# Altium schematic sheet Top.SchDoc
size A4; SheetNumber: 1; SheetTotal: 5
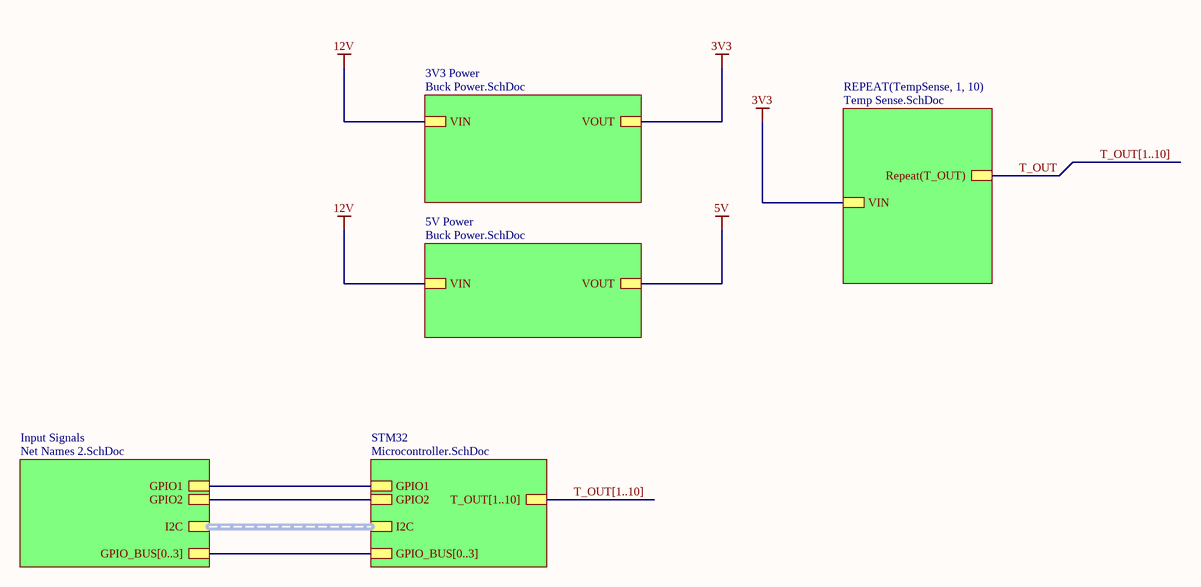
[diagram p0: Top.SchDoc]

## Sub-sheets
3V3 Power = Buck Power.SchDoc: VIN, VOUT
5V Power = Buck Power.SchDoc: VIN, VOUT
Input Signals = Net Names 2.SchDoc: GPIO1, GPIO2, I2C (harness I2C), GPIO_BUS[0..3]
REPEAT(TempSense, 1, 10) = Temp Sense.SchDoc: VIN, Repeat(T_OUT)
STM32 = Microcontroller.SchDoc: GPIO1, GPIO2, I2C (harness I2C), GPIO_BUS[0..3], T_OUT[1..10]

## Nets
3V3: sheet 3V3 Power/VOUT, sheet REPEAT(TempSense, 1, 10)/VIN
5V: sheet 5V Power/VOUT
12V: sheet 3V3 Power/VIN, sheet 5V Power/VIN
T_OUT: sheet REPEAT(TempSense, 1, 10)/Repeat(T_OUT)
(unnamed): sheet Input Signals/GPIO1, sheet STM32/GPIO1
(unnamed): sheet Input Signals/GPIO2, sheet STM32/GPIO2

## Buses and harness runs
bus sheet Input Signals/GPIO_BUS[0..3] = sheet STM32/GPIO_BUS[0..3]
bus T_OUT[1..10]
bus T_OUT[1..10] = sheet STM32/T_OUT[1..10]
harness sheet Input Signals/I2C = sheet STM32/I2C